# EAGLE design TT7N v1.2 (EAGLE 7.7.0)
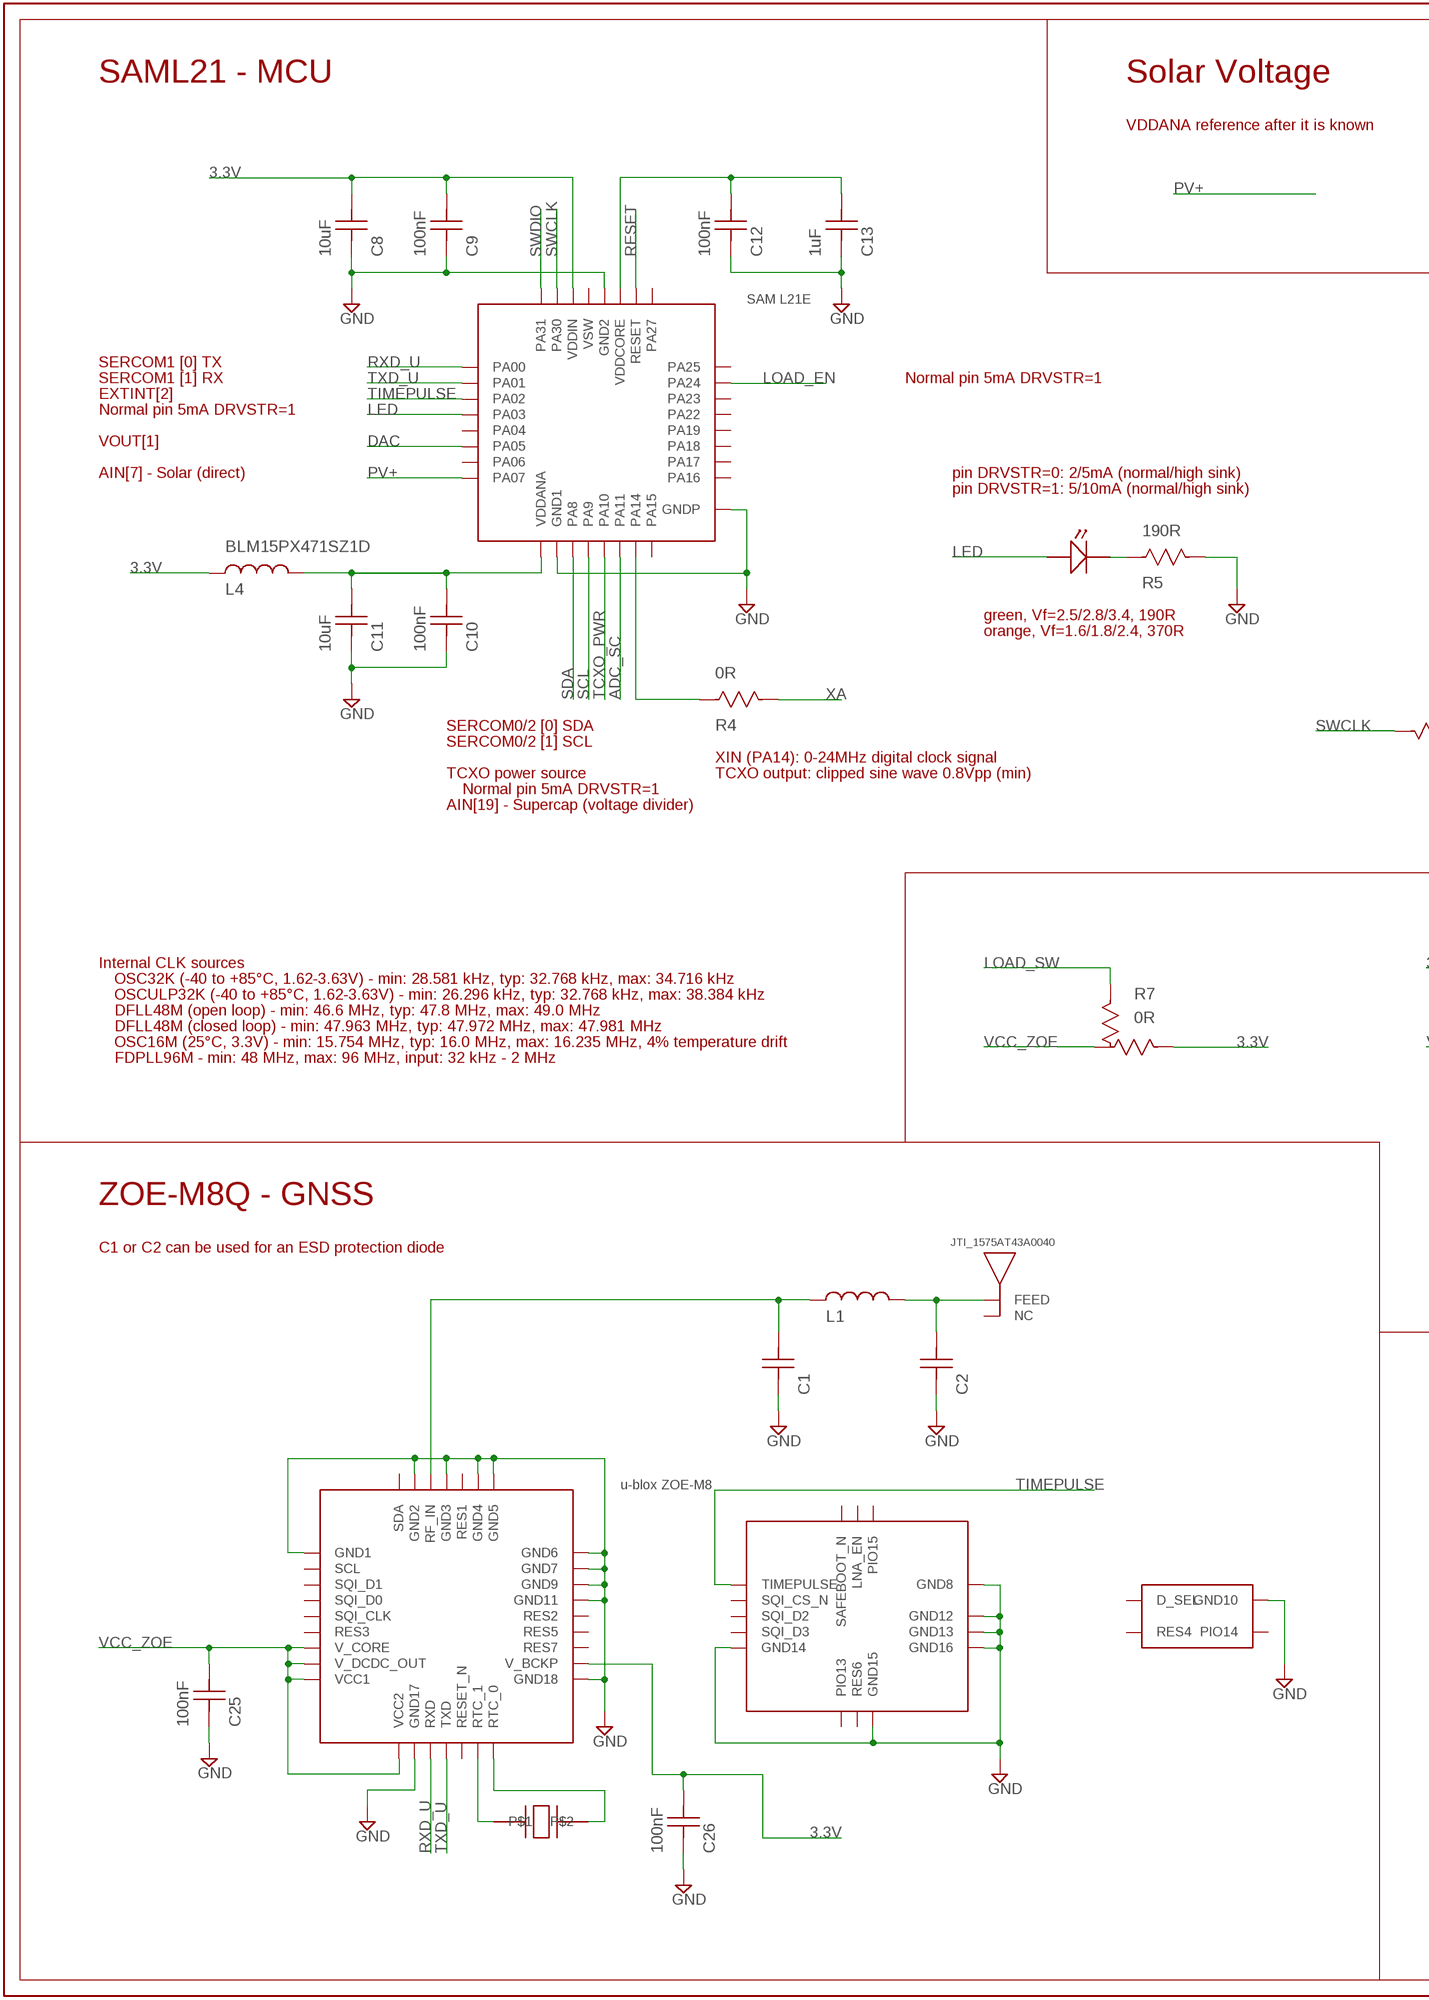
[diagram p0: schematic, sheet 1, part 1 of 2]
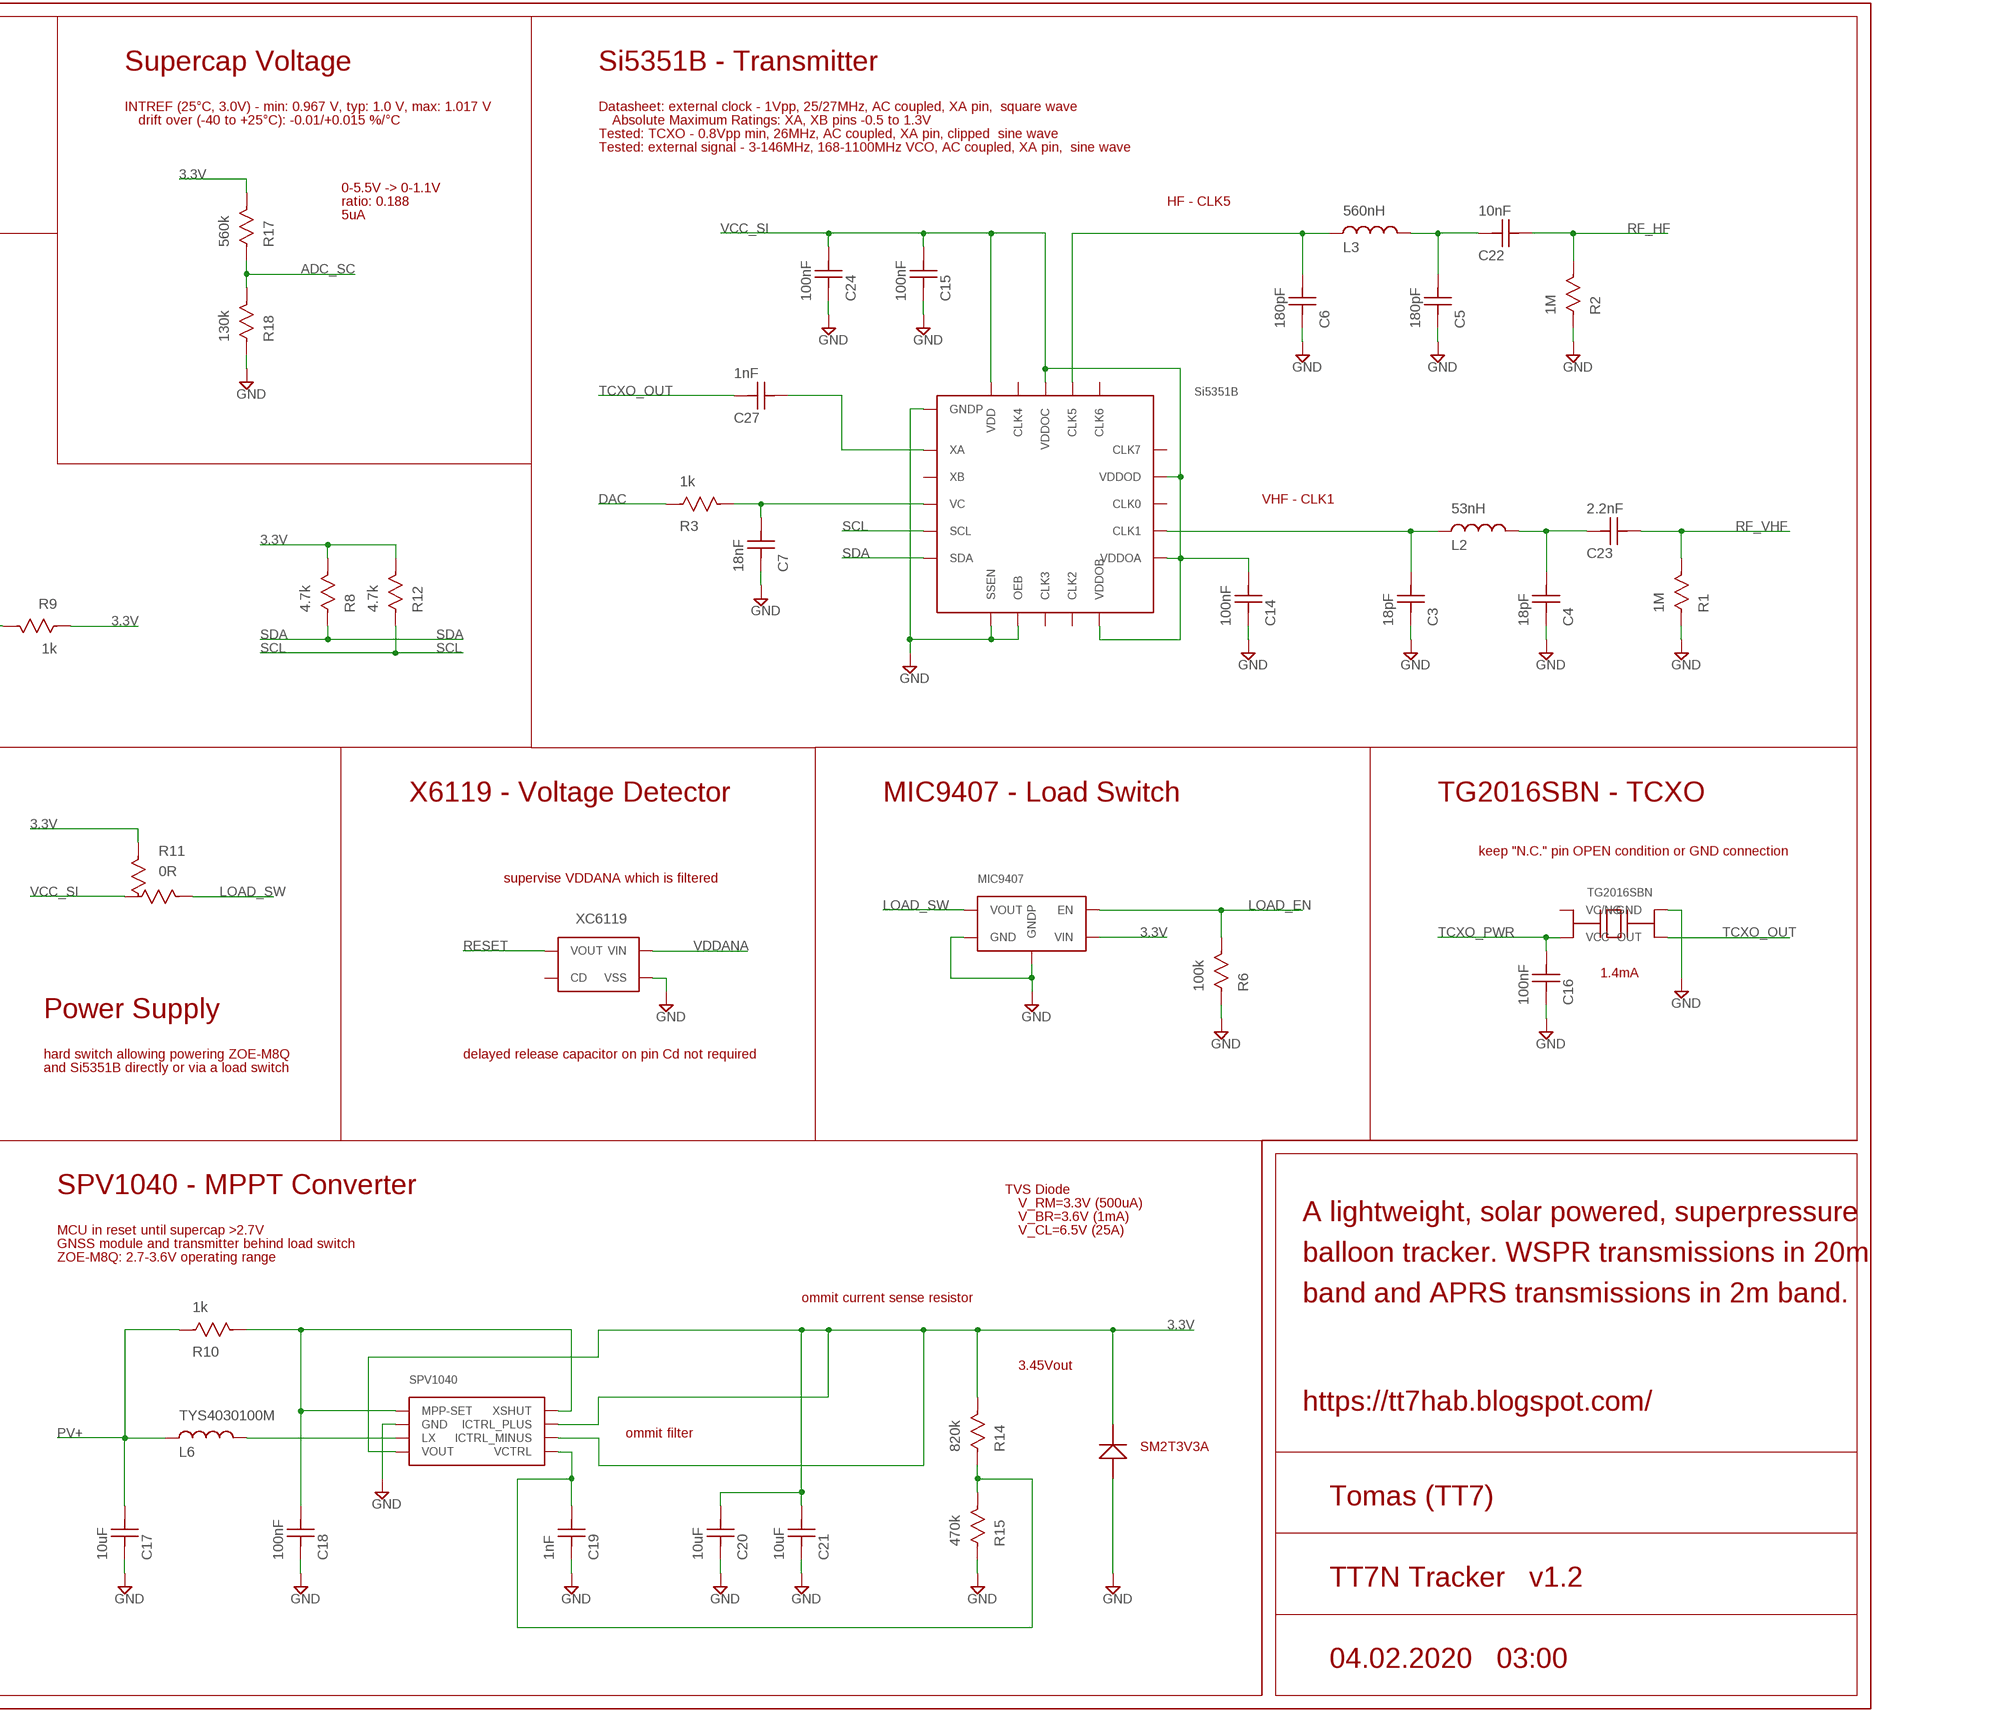
[diagram p1: schematic, sheet 1, part 2 of 2]

## Parts
ANT1  JTI_1575AT43A0040  [JTI_1575AT43A0040]
C1  CAP0402  [CAP0402]
C2  CAP0402  [CAP0402]
C3  18pF  CAP0402  [CAP0402]
C4  18pF  CAP0402  [CAP0402]
C5  180pF  CAP0402  [CAP0402]
C6  180pF  CAP0402  [CAP0402]
C7  18nF  CAP0402  [CAP0402]
C8  10uF  CAP0402  [CAP0402]
C9  100nF  CAP0402  [CAP0402]
C10  100nF  CAP0402  [CAP0402]
C11  10uF  CAP0402  [CAP0402]
C12  100nF  CAP0402  [CAP0402]
C13  1uF  CAP0402  [CAP0402]
C14  100nF  CAP0402  [CAP0402]
C15  100nF  CAP0402  [CAP0402]
C16  100nF  CAP0402  [CAP0402]
C17  10uF  CAP0402  [CAP0402]
C18  100nF  CAP0402  [CAP0402]
C19  1nF  CAP0402  [CAP0402]
C20  10uF  CAP0402  [CAP0402]
C21  10uF  CAP0402  [CAP0402]
C22  10nF  CAP0402  [CAP0402]
C23  2.2nF  CAP0402  [CAP0402]
C24  100nF  CAP0402  [CAP0402]
C25  100nF  CAP0402  [CAP0402]
C26  100nF  CAP0402  [CAP0402]
C27  1nF  CAP0402  [CAP0402]
D1  SM2T3V3A  [SM2T3V3A]
L1  IND0402  [IND0402]
L2  53nH  IND0402  [IND0402]
L3  560nH  IND0402  [IND0402]
L4  BLM15PX471SZ1D  IND0402  [IND0402]
L6  TYS4030100M  [TYS4030100M]
LED1  LED0603  [LED0603]
R1  1M  RES0402  [RES0402]
R2  1M  RES0402  [RES0402]
R3  1k  RES0402  [RES0402]
R4  0R  RES0402  [RES0402]
R5  190R  RES0402  [RES0402]
R6  100k  RES0402  [RES0402]
R7  0R  RES0402-3  [RES0402-3]
R8  4.7k  RES0402  [RES0402]
R9  1k  RES0402  [RES0402]
R10  1k  RES0402  [RES0402]
R11  0R  RES0402-3  [RES0402-3]
R12  4.7k  RES0402  [RES0402]
R14  820k  RES0402  [RES0402]
R15  470k  RES0402  [RES0402]
R17  560k  RES0402  [RES0402]
R18  130k  RES0402  [RES0402]
TCXO1  TG2016SBN  [TG2016SBN]
U1  SPV1040  [SPV1040]
U2  SAML21E18B-MUT  [SAML21E18B-MUT]
U3  XC6119  [XC6119]
U4  UBLOX_ZOE-M8  [UBLOX_ZOE-M8]
U5  SI5351B  [SI5351B]
U6  MIC9407  [MIC9407]
U7  CM8V-T1A  [CM8V-T1A]

## Nets
3.3V: C8.P$2 C9.P$2 C20.P$2 C21.P$2 C26.P$2 D1.CATHODE L4.P$1 R7.3 R8.P$2 R9.P$1 R11.1 R12.P$2 R14.P$2 R17.P$2 U1.ICTRL_MINUS U1.ICTRL_PLUS U1.VOUT U2.VDDIN U4.V_BCKP U6.VIN
ADC_SC: R17.P$1 R18.P$2 U2.PA11
CLK1: C3.P$2 L2.P$1 U5.CLK1
CLK5: C6.P$2 L3.P$1 U5.CLK5
DAC: R3.P$1 U2.PA05
GND: C1.P$1 C2.P$1 C3.P$1 C4.P$1 C5.P$1 C6.P$1 C7.P$1 C8.P$1 C9.P$1 C10.P$1 C11.P$1 C12.P$1 C13.P$1 C14.P$1 C15.P$1 C16.P$1 C17.P$1 C18.P$1 C19.P$1 C20.P$1 C21.P$1 C24.P$1 C25.P$1 C26.P$1 D1.ANODE R1.P$1 R2.P$1 R5.P$2 R6.P$1 R15.P$1 R18.P$1 TCXO1.GND U1.GND U2.GND1 U2.GND2 U2.GNDP U3.VSS U4.GND1 U4.GND2 U4.GND3 U4.GND4 U4.GND5 U4.GND6 U4.GND7 U4.GND8 U4.GND9 U4.GND10 U4.GND11 U4.GND12 U4.GND13 U4.GND14 U4.GND15 U4.GND16 U4.GND17 U4.GND18 U5.GNDP U5.OEB U5.SSEN U6.GND U6.GNDP
LED: LED1.ANODE U2.PA03
LOAD_EN: R6.P$2 U2.PA24 U6.EN
LOAD_SW: R7.1 R11.3 U6.VOUT
N$3: C7.P$2 R3.P$2 U5.VC
N$4: R4.P$1 U2.PA14
N$5: LED1.CATHODE R5.P$1
N$8: U4.RTC_0 U7.P$2
N$10: C12.P$2 C13.P$2 U2.VDDCORE
N$13: L6.P2 U1.LX
N$15: C5.P$2 C22.P$1 L3.P$2
N$16: C18.P$2 R10.P$2 U1.MPP-SET U1.XSHUT
N$19: C19.P$2 R14.P$1 R15.P$2 U1.VCTRL
N$20: U4.RTC_1 U7.P$1
N$22: C4.P$2 C23.P$1 L2.P$2
PV+: C17.P$2 L6.P1 R10.P$1 U2.PA07
RESET: U2.RESET U3.VOUT
RF_HF: C22.P$2 R2.P$2
RF_IN: C1.P$2 L1.P$1 U4.RF_IN
RF_UHF: ANT1.FEED C2.P$2 L1.P$2
RF_VHF: C23.P$2 R1.P$2
RXD_U: U2.PA00 U4.RXD
SCL: R12.P$1 U2.PA09(PA9) U5.SCL
SDA: R8.P$1 U2.PA08(PA8) U5.SDA
SWCLK: R9.P$2 U2.PA30
SWDIO: U2.PA31
TCXO_OUT: C27.P$1 TCXO1.OUT
TCXO_PWR: C16.P$2 TCXO1.VCC U2.PA10
TIMEPULSE: U2.PA02 U4.TIMEPULSE
TXD_U: U2.PA01 U4.TXD
VCC_SI: C14.P$2 C15.P$2 C24.P$2 R11.2 U5.VDD U5.VDDOA U5.VDDOB U5.VDDOC U5.VDDOD
VCC_ZOE: C25.P$2 R7.2 U4.V_CORE U4.V_DCDC_OUT U4.VCC1 U4.VCC2
VDDANA: C10.P$2 C11.P$2 L4.P$2 U2.VDDANA U3.VIN
XA: C27.P$2 R4.P$2 U5.XA
Unconnected: ANT1.NC TCXO1.VC/NC U2.PA04 U2.PA06 U2.PA15 U2.PA16 U2.PA17 U2.PA18 U2.PA19 U2.PA22 U2.PA23 U2.PA25 U2.PA27 U2.VSW U3.CD U4.D_SEL U4.LNA_EN U4.PIO13 U4.PIO14 U4.PIO15 U4.RES1 U4.RES2 U4.RES3 U4.RES4 U4.RES5 U4.RES6 U4.RES7 U4.RESET_N U4.SAFEBOOT_N U4.SCL U4.SDA U4.SQI_CLK U4.SQI_CS_N U4.SQI_D0 U4.SQI_D1 U4.SQI_D2 U4.SQI_D3 U5.CLK0 U5.CLK2 U5.CLK3 U5.CLK4 U5.CLK6 U5.CLK7 U5.XB

## Notes on the sheet
- SAML21 - MCU | Solar Voltage | Supercap Voltage | Si5351B - Transmitter
- VDDANA reference after it is known | INTREF (25°C, 3.0V) - min: 0.967 V, typ: 1.0 V, max: 1.017 V | Datasheet: external clock - 1Vpp, 25/27MHz, AC coupled, XA pin,  square wave
- drift over (-40 to +25°C): -0.01/+0.015 %/°C | Absolute Maximum Ratings: XA, XB pins -0.5 to 1.3V
- Tested: TCXO - 0.8Vpp min, 26MHz, AC coupled, XA pin, clipped  sine wave
- Tested: external signal - 3-146MHz, 168-1100MHz VCO, AC coupled, XA pin,  sine wave
- 0-5.5V -> 0-1.1V
- ratio: 0.188 | HF - CLK5
- 5uA
- SERCOM1 [0] TX
- SERCOM1 [1] RX | Normal pin 5mA DRVSTR=1
- EXTINT[2]
- Normal pin 5mA DRVSTR=1
- VOUT[1]
- AIN[7] - Solar (direct) | pin DRVSTR=0: 2/5mA (normal/high sink)
- pin DRVSTR=1: 5/10mA (normal/high sink)
- VHF - CLK1
- green, Vf=2.5/2.8/3.4, 190R
- orange, Vf=1.6/1.8/2.4, 370R
- SERCOM0/2 [0] SDA
- SERCOM0/2 [1] SCL
- XIN (PA14): 0-24MHz digital clock signal
- TCXO power source | TCXO output: clipped sine wave 0.8Vpp (min)
- Normal pin 5mA DRVSTR=1
- AIN[19] - Supercap (voltage divider)
- X6119 - Voltage Detector | MIC9407 - Load Switch | TG2016SBN - TCXO
- Internal CLK sources
- OSC32K (-40 to +85°C, 1.62-3.63V) - min: 28.581 kHz, typ: 32.768 kHz, max: 34.716 kHz
- OSCULP32K (-40 to +85°C, 1.62-3.63V) - min: 26.296 kHz, typ: 32.768 kHz, max: 38.384 kHz | keep "N.C." pin OPEN condition or GND connection
- DFLL48M (open loop) - min: 46.6 MHz, typ: 47.8 MHz, max: 49.0 MHz
- DFLL48M (closed loop) - min: 47.963 MHz, typ: 47.972 MHz, max: 47.981 MHz | supervise VDDANA which is filtered
- OSC16M (25°C, 3.3V) - min: 15.754 MHz, typ: 16.0 MHz, max: 16.235 MHz, 4% temperature drift
- FDPLL96M - min: 48 MHz, max: 96 MHz, input: 32 kHz - 2 MHz
- 1.4mA
- Power Supply
- ZOE-M8Q - GNSS
- hard switch allowing powering ZOE-M8Q | delayed release capacitor on pin Cd not required
- C1 or C2 can be used for an ESD protection diode | and Si5351B directly or via a load switch
- SPV1040 - MPPT Converter | TVS Diode
- V_RM=3.3V (500uA)
- V_BR=3.6V (1mA) | A lightweight, solar powered, superpressure
- MCU in reset until supercap >2.7V | V_CL=6.5V (25A)
- GNSS module and transmitter behind load switch
- ZOE-M8Q: 2.7-3.6V operating range | balloon tracker. WSPR transmissions in 20m
- ommit current sense resistor | band and APRS transmissions in 2m band.
- 3.45Vout
- https://tt7hab.blogspot.com/
- ommit filter
- SM2T3V3A
- Tomas (TT7)
- TT7N Tracker   v1.2
- 04.02.2020   03:00

## Library data of the parts
ANT1 = TT7:JTI_1575AT43A0040: JTI_1575AT43A0040 GNSS antenna footprint.
C1-C27 = TT7:CAP0402: CAPACITOR 0402 - 1 x 0.5 x 0.35mm
D1 = TT7:SM2T3V3A: SM2T3V3A TVS diode footprint
L1-L4 = TT7:IND0402: INDUCTOR 0402 - 1 x 0.5 x 0.35mm
L6 = TT7:TYS4030100M: TYS4030100M inductor footprint.
LED1 = TT7:LED0603: LED 0603
R1-R6 R8-R10 R12 R14 R15 R17 R18 = TT7:RES0402: RESISTOR 0402 - 1 x 0.5 x 0.35mm
R7 R11 = TT7:RES0402-3: Resistor Switch.
TCXO1 = TT7:TG2016SBN: TG2016SBN TCXO in a 2.0x1.6mm package.
U1 = TT7:SPV1040: SPV1040 high efficiency solar battery charger with embedded MPPT in a TSSOP8 package.
U2 = TT7:SAML21E18B-MUT: Atmel's SAM L21E18B in a 32 pin QFN package.
U3 = TT7:XC6119: XC6119 supervisor IC in a USPN-4 package.
U4 = TT7:UBLOX_ZOE-M8: U-blox ZOE-M8 footprint.
U5 = TT7:SI5351B: Si5351B transmitter.
U6 = TT7:MIC9407: MIC9407 load switch in MLF package footprint.
U7 = TT7:CM8V-T1A: CM8V-T1A 32.768kHz crystal footprint.

## Board
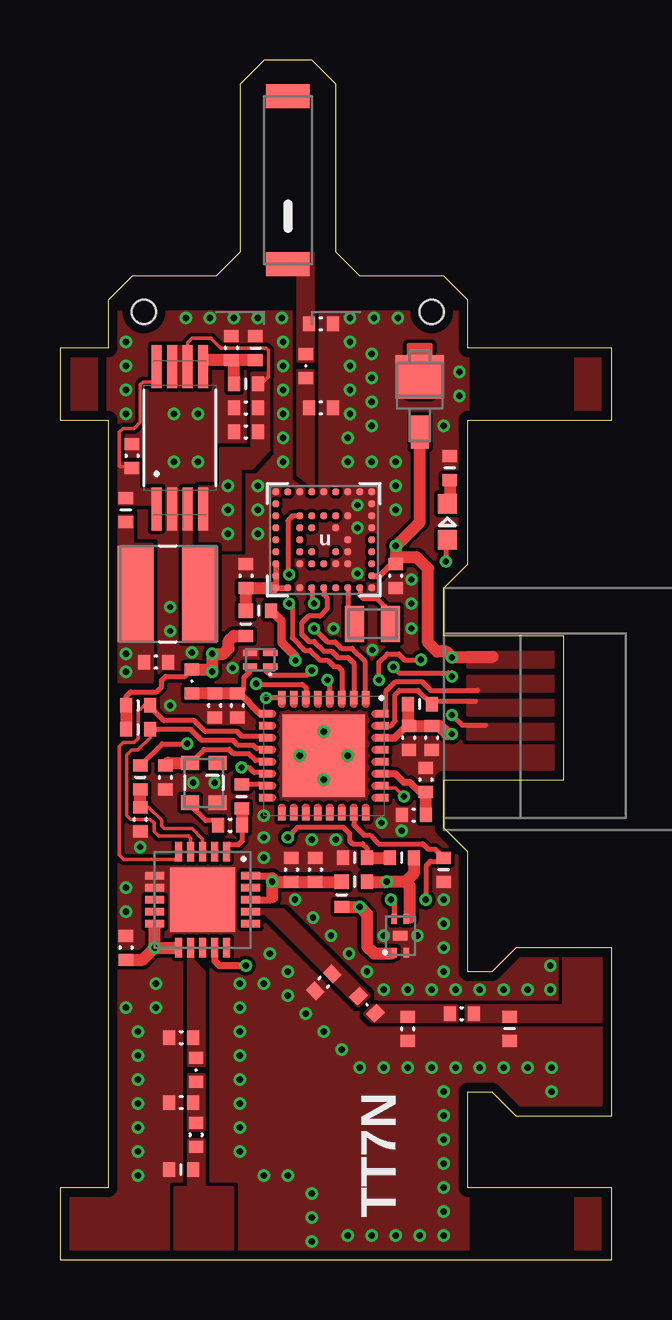
[diagram p2: board, top side]
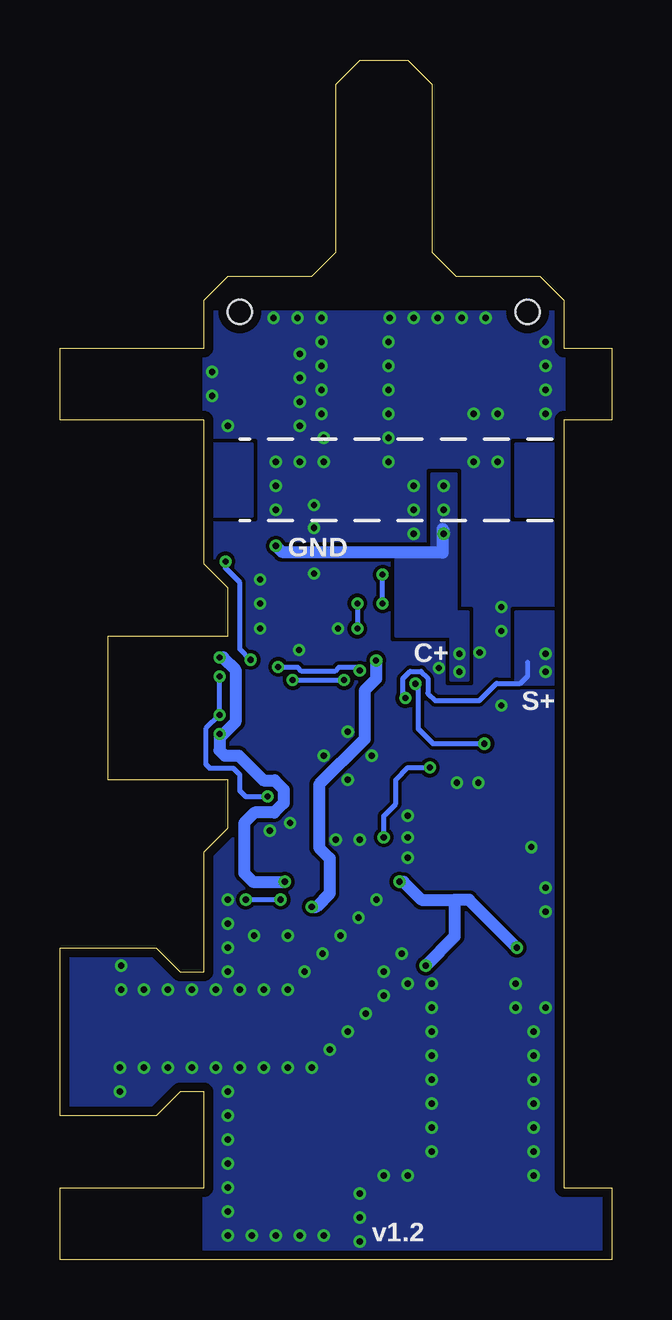
[diagram p3: board, bottom side, seen from below]

Size 23 x 50 mm. Coordinates in mm from the lower left corner, seen from the top.
Outline: 0,0 23,0 23,3 17,3 17,7 18,7 19,6 23,6 23,13 19,13 18,12 17,12 17,17 16,18 16,20 21,20 21,26 16,26 16,28 17,29 17,35 23,35 23,38 17,38 17,40 16,41 12.5,41 11.5,42 11.5,49 10.5,50 8.5,50 7.5,49 7.5,42 6.5,41 3,41 2,40 2,38 0,38 0,35 2,35 2,3 0,3 0,0
Copper layers (1*16): Top 0.035559375mm / dielectric 1.6mm / Bottom 0.035559375mm
Design rules "oshpark-2layer *": minimum track width 6mil, minimum drill 10mil, track to track 6mil, track to pad 6mil, pad to pad 6mil, via to via 6mil, smd to smd 0mil, copper to edge 15mil, drill to drill 6mil, minimum pad ring 5mil, minimum via ring 5mil, stop-mask expansion 2.5mil, vias tented up to drill 22mil, thermal gap 10mil
Holes 1 mm at 15.5,39.5 3.5,39.5

### Footprints (pad centres in the part's own frame; a part is rotated, then mirrored left to right if it is on the bottom)
JTI_1575AT43A0040 = smd 1 x 1.8: FEED -3.5,0; NC 3.5,0
CAP0402 = smd 0.5 x 0.6: P$1 -0.5,0; P$2 0.5,0
SM2T3V3A = smd 1.82 x 2.03: ANODE -0.79,0 | smd 1.38 x 0.75: CATHODE 1.515,0
IND0402 = smd 0.5 x 0.6: P$1 -0.5,0; P$2 0.5,0
TYS4030100M = smd 1.5 x 4: P1 -1.35,0; P2 1.35,0
LED0603 = smd 0.8 x 0.8: ANODE -0.75,0; CATHODE 0.75,0
RES0402 = smd 0.5 x 0.6: P$1 -0.5,0; P$2 0.5,0
RES0402-3 = smd 0.6 x 0.5: 1 -0.55,1.05 | smd 0.6 x 0.6: 2 -0.55,0 | smd 0.5 x 0.6: 3 0.5,0
TG2016SBN = smd 0.6 x 0.75: GND 0.825,0.565; OUT 0.825,-0.565; VC/NC -0.825,0.565; VCC -0.825,-0.565
SPV1040 = smd 1.78 x 0.42: GND -2.97,0.325; ICTRL_MINUS 2.97,-0.325; ICTRL_PLUS 2.97,0.325; LX -2.97,-0.325; MPP-SET -2.97,0.975; VCTRL 2.97,-0.975; VOUT -2.97,-0.975; XSHUT 2.97,0.975
SAML21E18B-MUT = smd 0.3 x 0.55: GND1 -1.25,-2.425; GND2 0.25,2.425; PA08 -0.75,-2.425; PA09 -0.25,-2.425; PA10 0.25,-2.425; PA11 0.75,-2.425; PA14 1.25,-2.425; PA15 1.75,-2.425; PA27 1.75,2.425; PA30 -1.25,2.425; PA31 -1.75,2.425; RESET 1.25,2.425; VDDANA -1.75,-2.425; VDDCORE 0.75,2.425; VDDIN -0.75,2.425; VSW -0.25,2.425 | smd 3.45 x 3.45: GNDP 0,0 | smd 0.55 x 0.3: PA00 -2.425,1.75; PA01 -2.425,1.25; PA02 -2.425,0.75; PA03 -2.425,0.25; PA04 -2.425,-0.25; PA05 -2.425,-0.75; PA06 -2.425,-1.25; PA07 -2.425,-1.75; PA16 2.425,-1.75; PA17 2.425,-1.25; PA18 2.425,-0.75; PA19 2.425,-0.25; PA22 2.425,0.25; PA23 2.425,0.75; PA24 2.425,1.25; PA25 2.425,1.75
XC6119 = smd 0.25 x 0.6: CD 0.275,-0.425; VIN -0.275,0.425; VOUT -0.275,-0.425; VSS 0.275,0.425
UBLOX_ZOE-M8 = smd 0.27 x 0.27: D_SEL -0.5,0.5; GND1 -2,2; GND2 -1,2; GND3 0,2; GND4 1,2; GND5 1.5,2; GND6 2,2; GND7 2,1.5; GND8 1,1; GND9 2,1; GND10 0.5,0.5; GND11 2,0.5; GND12 1,0; GND13 1,-0.5; GND14 -1,-1; GND15 0.5,-1; GND16 1,-1; GND17 -1,-2; GND18 2,-2; LNA_EN 0,1; PIO13 -0.5,-1; PIO14 0.5,-0.5; PIO15 0.5,1; RES1 0.5,2; RES2 2,0; RES3 -2,-0.5; RES4 -0.5,-0.5; RES5 2,-0.5; RES6 0,-1; RES7 2,-1; RESET_N 0.5,-2; RF_IN -0.5,2; RTC_0 1.5,-2; RTC_1 1,-2; RXD -0.5,-2; SAFEBOOT_N -0.5,1; SCL -2,1.5; SDA -1.5,2; SQI_CLK -2,0; SQI_CS_N -1,0.5; SQI_D0 -2,0.5; SQI_D1 -2,1; SQI_D2 -1,0; SQI_D3 -1,-0.5; TIMEPULSE -1,1; TXD 0,-2; V_BCKP 2,-1.5; V_CORE -2,-1; V_DCDC_OUT -2,-1.5; VCC1 -2,-2; VCC2 -1.5,-2
SI5351B = smd 0.8 x 0.3: CLK0 2,0; CLK1 2,-0.5; CLK7 2,1; SCL -2,-0.5; SDA -2,-1; VC -2,0; VDDOA 2,-1; VDDOD 2,0.5; XA -2,1; XB -2,0.5 | smd 0.3 x 0.8: CLK2 0.5,-2; CLK3 0,-2; CLK4 -0.5,2; CLK5 0.5,2; CLK6 1,2; OEB -0.5,-2; SSEN -1,-2; VDD -1,2; VDDOB 1,-2; VDDOC 0,2 | smd 2.7 x 2.7: GNDP 0,0
MIC9407 = smd 0.23 x 0.4: EN -0.25,0.7; GND 0.25,-0.7; VIN 0.25,0.7; VOUT -0.25,-0.7 | smd 0.6 x 0.4: GNDP 0,0
CM8V-T1A = smd 0.8 x 1.5: P$1 -0.75,0; P$2 0.75,0

### Placement (x,y rotation side)
ANT1  9.5,45 90 top
C1  10.88,35.5 180 top
C2  10.88,39 180 top
C3  5.05,9.25 0 top
C4  5.05,6.55 0 top
C5  14.5,9.62 90 top
C6  11,11.55 45 top
C7  3.35,18.35 90 top
C8  15.5,21.75 90 top
C9  14.55,21.75 90 top
C10  7.4,23.1 90 top
C11  6.45,23.1 90 top
C12  15.25,20 270 top
C13  14.75,18.53 0 top
C14  2.75,13 270 top
C15  10.65,16.25 270 top
C16  4.4,20.1 90 top
C17  4,24.9 180 top
C18  3,33.5 270 top
C19  7.15,38 270 top
C20  7.75,35.5 0 top
C21  7.75,34.5 0 top
C22  16.75,10.25 0 top
C23  5.67,5.2 270 top
C24  9.65,16.25 270 top
C25  7.75,28.5 270 top
C26  14,28.5 90 top
C27  7.1,18.1 0 top
D1  15,36 270 top
L1  10.25,37.25 90 top
L2  5.67,7.9 270 top
L3  12.8,10.62 315 top
L4  5.5,24.1 270 top
L6  4.5,27.75 0 top
LED1  16.15,30.75 90 top
R1  5.05,3.75 0 top
R2  18.75,9.62 90 top
R3  3.35,20.1 270 top
R4  7.58,19.3 270 top
R5  16.25,33 90 top
R6  16,16.25 90 top
R7  7.75,26.5 270 top
R8  3.25,23.1 180 top
R9  15,23.15 0 top
R10  2.75,31.25 90 top
R11  11.75,15.2 270 top
R12  3.25,22.1 180 top
R14  7.75,36.5 0 top
R15  8.15,38 270 top
R17  14.25,16.75 0 top
R18  12.3,16.75 0 top
TCXO1  6,19.88 270 top
U1  5,34.25 90 top
U2  11,21 270 top
U3  8.35,25 90 top
U4  11,30 0 top
U5  5.95,15 270 top
U6  14.2,13.5 0 top
U7  13.03,26.5 0 top

### Tracks (layer width: path | path; a pad name or v marks a point on that pad's centre or on a via)
3.3V  (via drill 0.25)
  Top 0.152: U1.ICTRL_MINUS 5.33,38.23 5.5,38.4 6.3,38.4 6.3,38.39 6.69,38 8.6,38 8.7,37.9 8.7,36.81 8.39,36.5 R14.P$2
  Top 0.2: R8.P$2 2.75,23.46 2.95,23.66 4.04,23.66 4.24,23.86 4.24,24.14 4.4,24.3 5.2,24.3 L4.P$1 | U6.VIN 14.53,14.2 14.58,14.25
  Top 0.26: U4.V_BCKP 13.32,28.5 13.82,29 C26.P$2
  Top 0.31: U2.VDDIN 13.95,21.75 14.45,22.25 C9.P$2
  Top 0.5: R8.P$2 R12.P$2 | C26.P$2 v14,29.75 15,30.75 D1.CATHODE | L4.P$1 6.25,24.6 v6.35,24.5 v6.35,25.25 6.8,25.25 7.04,25.48 7.04,25.79 7.24,26 R7.3 | R9.P$1 14.5,22.25 C9.P$2 C8.P$2 15.8,22.25 16.15,21.9 v16.35,21.9 | 18.04,25.12 16.37,25.12 v16.35,25.1 16.11,25.34 15.72,25.34 15.35,25.72 15.35,28.8 14.88,29.26 14,29.26 C26.P$2 | C26.P$2 14.05,29.15 | R11.1 v13.62,15.75 14.4,15.75 | R17.P$2 14.75,16.1 14.4,15.75 | 14.4,15.75 14.58,15.57 14.58,14.25
  Bottom 0.5: v14,29.75 13.75,29.5 7.07,29.5 7.03,29.46 7.03,30.47 v7,30.25 | v16.35,25.1 16.19,25.1 15.68,24.59 15.68,22.41 16.19,21.9 v16.35,21.9 16.35,21.22 16.13,21.01 15.55,21.01 14.51,19.97 14.05,19.97 13.67,19.59 13.67,19.03 13.68,19.03 14.07,18.63 14.88,18.63 15.31,18.2 15.31,16.11 14.96,15.75 v13.62,15.75
  other vias: 7,31.25 7,32.25
  pour Top: 17,25.3 21,25.3 21,24.7 17,24.7
  pour Top (no thermals): 7.5,29.6 7.5,33 8,33 8,33.8 6.7,33.8 6.7,32.2 5.84,32.2 5.84,29.95 6.8,29.95 6.8,29.6
  pour Top (no thermals): 4.55,38.05 5.45,38.05 5.45,36.4 4.55,36.4
  pour Top (no thermals): 8,36.95 8.7,36.95 8.7,33.75 8,33
  pour Bottom (no thermals): 6.5,32.75 7.5,32.75 7.5,29.5 9,29.5 9,26 6.7,26 6.7,24.15 6,24.15 6,27 6.5,27
ADC_SC  (via drill 0.25)
  Top 0.2: U2.PA11 8.53,20.3 8.1,20.3 7.88,20.51 v7.58,20.51 | v9.5,17.6 9.93,18.03 11.81,18.03 12.07,17.76 12.07,17.45 12.19,17.33 12.62,17.33 12.8,17.15 R18.P$2
  Top 0.5: R18.P$2 R17.P$1
  Bottom 0.2: v9.5,17.6 9.5,18.5 9,19 9,20 8.49,20.51 v7.58,20.51
CLK1
  pour Top (no thermals): 5.36,8.1 5.36,12.9 5.53,12.9 5.53,12.5 6,12 6,8.1
CLK5
  pour Top (no thermals): 9,14 12.45,10.55 12.9,11 12.43,11.47 10.43,13.47 9.32,14.57 7.65,14.57 7.65,14.43 8.55,14.43
DAC  (via drill 0.25)
  Top 0.2: R3.P$1 4.25,21.5 v5.3,21.5 | v8.18,24 8.2,23.98 10.11,23.98 10.25,23.84 U2.PA05
  Bottom 0.2: v5.3,21.5 7.43,21.5 8.07,22.13 8.07,23.89 v8.18,24
GND  (via drill 0.25)
  other vias: 9.25,39.25 9.3,37.25 9.3,35.25 9.3,33.25 12.1,39.25 12.1,37.25 12.1,35.25 3.25,3.5 3.25,5.5 3.25,7.5 3.25,9.5 12,33.25 9.3,38.25 9.3,36.25 9.3,34.25 12,34.25 12.1,36.25 12.1,38.25 3.25,4.5 3.25,6.5 3.25,8.5 4,10.5 4,11.5 16,6 16,4 16,2 14,1 12,1 10.5,2.75 10.5,1.75 7.5,9.5 7.5,8.5 7.5,7.5 7.5,6.5 7.5,5.5 7.5,4.5 8.5,3.5 9.5,3.5 7.5,10.5 7.5,11.5 10.5,0.75 13,1 16,3 16,5 16,1 2.75,10.5 13.1,39.25 8.25,39.25 14.1,39.25 7.25,39.25 6.25,39.25 5.25,39.25 16,7 15.5,8 16.5,8 17.5,8 18.5,8 20.5,8 20.5,7 14.5,8 13.5,8 11.75,8.75 20.45,12.25 18.5,11.25 20.45,11.25 17.5,11.25 16.5,11.25 15.5,11.25 14.5,11.25 12.5,8 13.5,11.25 12.8,12 11,9.5 10.25,10.25 9.5,11 8.5,11.5 12.05,12.75 11.3,13.5 10.55,14.25 9.5,12 8.75,12.75 8.25,30.25 8.25,31.25 8.25,32.25 2.75,36.25 2.75,37.25 2.75,38.25 2.75,35.25 13,33.25 5.55,19.88 4.75,33.25 5.75,33.25 4.75,35.25 5.75,35.25 2.75,15.5 2.75,14.5 19.5,11.25 19.5,8 15,1 14,33.25 14,32.25 14,31.25 9.8,15 8.5,16.75 8.5,17.6 16,34.75 16.65,37 16.65,36 14.65,28.35 12.4,28.6 12.4,30.5 12.4,31.45 11.4,26.3 14.65,26.3 14.65,27.35 13.03,25.4 13,34.75 13,37.75 13,36.75 13,35.75 3.35,17.19 6.45,19.88 4.6,23.1 5.5,25.3 4.6,26.2 4.6,27.2 7.2,24.65 11,22 11,20 12,21 10,21 16,12 16,13 16,14 10.5,17.5 8.5,18.5 11.5,17.5 16,15 13.4,18.2 14.25,17.88 13.5,13.5 14.9,13.5
  pour Top (rank 2, no thermals): 0,0 17,0 17,6 23,6 23,13 17,13 17,20 21,20 21,26 17,26 17,39.5 2,39.5 2,3 0,3
  pour Bottom (rank 2, no thermals): 2,39.5 17,39.5 17,26 21,26 21,20 17,20 17,13 23,13 23,6 17,6 17,0 0,0 0,3 2,3
LED  (via drill 0.25)
  Top 0.2: U2.PA03 11.25,24.05 v11.15,24.15 | v13.3,24.15 13.3,24.9 13.65,25.24 14.12,25.24 14.36,25 v15.05,25 | LED1.ANODE 16.1,29.95 v16.1,29.1
  Bottom 0.2: v13.3,24.15 v11.15,24.15 | v15.05,25 15.5,25.45 15.5,28.21 16.1,28.82 v16.1,29.1
LOAD_EN  (via drill 0.25)
  Top 0.152: 15.13,17.33 14.25,17.33
  Top 0.2: U2.PA24 12.25,18.12 12.67,17.7 12.92,17.7 13.29,17.33 15.13,17.33 15.35,17.11 15.64,17.11 R6.P$2 15.85,16.59 15.45,16.59 15.27,16.42 15.27,15.02 v15.25,15
  Top 0.23: U6.EN 13.95,14.86 v13.8,15
  Bottom 0.2: v13.8,15 v15.25,15
LOAD_SW  (via drill 0.25)
  Top 0.2: U6.VOUT 13.89,12.75 13.81,12.75
  Top 0.35: v9.82,24.97 9.82,25.14 9.24,25.72 9.24,26.61 R7.1
  Top 0.5: R11.3 v12.5,14.7 12.81,14.39 12.81,13.05 13.11,12.75 13.81,12.75
  Bottom 0.5: v9.82,24.97 9.82,24.2 10.3,23.71 10.3,21.68 12.19,19.79 12.19,17.16 11.75,16.72 11.75,15.26 12.31,14.7 v12.5,14.7
N$1
  pour Top: 21.5,35 21.5,38 22.5,38 22.5,35
N$2
  pour Top: 21.5,0 21.5,3 22.5,3 22.5,0
N$3
  Top 0.152: U5.VC 5.95,17.52 5.5,17.97 4.34,17.97 4.23,18.08 4.23,18.32 3.71,18.85 C7.P$2
  Top 0.5: C7.P$2 R3.P$2
N$4
  Top 0.2: U2.PA14 8.53,19.8 R4.P$1
N$5
  Top 0.5: R5.P$1 16.25,31.6 LED1.CATHODE
N$6
  pour Bottom (no thermals): 17,31 15,31 15,34 17,34
N$7
  pour Bottom (no thermals): 2,34 4,34 4,31 2,31
N$8
  Top 0.2: U4.RTC_0 12.5,27.7 12.65,27.55 13.23,27.55 13.78,27 U7.P$2
  Top 0.26: 13.51,26.77 U7.P$2
N$10
  Top 0.3: 13.75,20.25 U2.VDDCORE 13.98,20.25 14.35,19.88 14.6,19.88 14.98,19.5 C12.P$2
  Top 0.5: C13.P$2 C12.P$2
N$13
  Top 0.152: L6.P2 5.33,27.75 5.33,29.02
  pour Top (no thermals): 5.17,32 5.47,32 5.47,28 5.17,28
N$15
  pour Top (no thermals): 16.55,9.94 16.55,10.57 13.03,10.57 12.7,10.25 13,9.94
N$16
  Top 0.152: U1.MPP-SET 4,31.28 4,32 | U1.XSHUT 4.02,36.63 3.96,36.58 3.46,36.58 3.35,36.47 3.35,34.9 3.09,34.64 2.62,34.64 2.46,34.49 2.46,33.07 2.49,33.05 2.95,33.05 C18.P$2
  pour Top (no thermals): 2,31.5 4.17,31.5 4.17,32.1 3.25,32.1 3.25,33.2 2,33.2
N$19
  Top 0.4: 8.2,37.45 R15.P$2 | 6.05,37.5 U1.VCTRL
  Top 0.5: R15.P$2 C19.P$2 | C19.P$2 6.05,37.5 | R14.P$1 7.25,37.4 C19.P$2
N$20
  Top 0.2: U4.RTC_1 12,26.77
  Top 0.26: 12,26.75 U7.P$1 12,26.77
N$21
  pour Top: 0.5,35 0.5,38 1.5,38 1.5,35
N$22
  pour Top (no thermals): 5.36,5.4 5.36,7.7 6,7.7 6,5.4
PV+  (via drill 0.25)
  Top 0.2: U2.PA07 9.22,23.4 v8.6,23.4
  Bottom 0.2: v8.6,23.4 8.7,23.5 8.7,24.22 8.4,24.52 7.95,24.52 7.66,24.23 7.66,23.6 7.35,23.3 5.52,23.3 4.8,24.02 3.8,24.02 3.5,24.32 C17.P$2
  other vias: 2.75,25.25 2.75,24.5
  pour Top (no thermals): 2,24.1 3.85,24.1 3.85,29.8 3,29.8 3,31 2,31
  pour Bottom (no thermals): 2,27 4,27 4,24 2,24
RESET  (via drill 0.25)
  Top 0.152: v14.35,19.3 13.98,19.66 13.51,19.66 U2.RESET
  Top 0.2: v10.5,24.55 10.29,24.34 8.79,24.34 8.57,24.56 8.57,24.73 U3.VOUT | v16.35,22.7 16.78,22.27 17.74,22.27 | v13.9,24.7 14.14,24.45 16.2,24.45 v16.35,24.3
  Bottom 0.2: v10.5,24.55 10.63,24.68 11.38,24.68 11.54,24.52 12.92,24.52 13.08,24.68 13.88,24.68 v13.9,24.7 | v16.35,24.3 v16.35,22.7 16.92,22.13 16.92,20.65 16.76,20.49 15.78,20.49 15.51,20.22 15.51,19.55 15.26,19.3 v14.35,19.3
  pour Top: 17,22.3 21,22.3 21,21.7 17,21.7
RF_HF
  pour Top (no thermals): 16.95,9.94 23,9.94 23,13 21,13 21,10.57 16.95,10.57
RF_IN
  pour Top (no thermals): 9.92,32.7 9.92,37.05 10.56,37.05 10.56,32 10.44,32 10.44,32.3
RF_UHF
  pour Top (no thermals): 9.92,41.92 10.56,41.92 10.56,37.45 9.92,37.45
RF_VHF
  pour Top (no thermals): 5.36,5 6,5 6,3 7.2,3 7.2,0 4.8,0 4.8,3 5.36,3
RXD_U  (via drill 0.25)
  Top 0.2: U4.RXD 10.5,27.45 v10.6,27.35 | v10.6,26.3 11.16,25.74 11.47,25.74 11.74,25.47 12.18,25.47 12.71,24.94 12.71,23.46 U2.PA00
  Bottom 0.2: v10.6,27.35 v10.6,26.3
SCL
  Top 0.152: U5.SCL 5.45,17.56 5.36,17.65 4.11,17.65 3.92,17.84 3.92,18.19 3.76,18.35 2.95,18.35 2.79,18.52 2.79,21.04 2.99,21.24 3.24,21.24 3.75,21.75 R12.P$1
  Top 0.2: U2.PA09 8.53,21.2 8.53,21.3 8.2,21.3 8.07,21.43 7.43,21.43 7.23,21.64 5.9,21.64 5.44,22.1 R12.P$1
SDA
  Top 0.152: 4.95,17.25 U5.SDA 4.95,16.68 2.66,16.68 2.47,16.87 2.47,21.38 2.64,21.56 3.1,21.56 3.25,21.71 3.25,22.85 3.5,23.1 R8.P$1
  Top 0.2: U2.PA08 8.52,21.8 7.59,21.8 7.39,22.01 6.06,22.01 5.6,22.46 4.32,22.46 3.75,23.04 R8.P$1
SWCLK
  Top 0.2: U2.PA30 13.8,22.25 13.98,22.43 13.98,23.55 14.15,23.72 14.93,23.72 R9.P$2 15.62,23.27 17.33,23.27
  pour Top: 21,22.7 17,22.7 17,23.3 21,23.3
SWDIO
  Top 0.2: U2.PA31 13.6,22.75 13.6,23.69 14,24.09 15.1,24.09 15.46,23.72 17.42,23.72
  pour Top: 21,23.7 17,23.7 17,24.3 21,24.3
TCXO_OUT
  Top 0.2: C27.P$1 6.4,18.3 6.07,18.3 5.44,18.94 TCXO1.OUT
TCXO_PWR
  Top 0.2: TCXO1.VCC 6,21.27 7.06,21.27 7.25,21.08 7.87,21.08 8.15,20.8 8.57,20.8 U2.PA10
  Top 0.5: C16.P$2 4.5,20.7 TCXO1.VCC
TIMEPULSE  (via drill 0.25)
  Top 0.2: U4.TIMEPULSE 9.7,31 9.5,30.8 9.5,28.6 v9.55,28.55 | v9.55,27.35 9.69,27.21 9.69,25.9 10.2,25.39 10.44,25.39 10.84,24.98 11.15,24.98 11.42,24.71 11.59,24.71 11.76,24.55 U2.PA02
  Bottom 0.2: v9.55,27.35 v9.55,28.55
TXD_U
  Top 0.2: U4.TXD 11,27.71 11.14,27.57 11.14,27.13 10.83,26.82 10.37,26.82 10.07,26.52 10.07,26.07 10.38,25.77 10.6,25.77 11.01,25.36 11.31,25.36 11.58,25.09 12.01,25.09 12.25,24.85 U2.PA01
VCC_SI  (via drill 0.25)
  Top 0.2: 3.95,13.85 U5.VDDOB | 4.8,13 U5.VDDOA | 8.81,15 8.8,15.01 8.8,15.1 8.85,15.1 | 8.85,16 v8.85,15.75
  Top 0.3: U5.VDDOD 6.45,12.45 6.65,12.25 v7.75,12.25 | U5.VDDOC 8.81,15 | U5.VDD 8.85,16
  Top 0.5: C14.P$2 3.45,12.5 v3.95,13 | v3.95,13 3.95,13.85 | v3.95,13 4.8,13 | v8.85,15.75 8.85,15.1 | v8.85,15.75 C24.P$2 C15.P$2 R11.2 | 8.85,15.9 v8.85,15.75
  Bottom 0.5: v3.95,13 5.95,15 6.53,15 | v7.75,12.25 6.53,13.47 6.53,15 | 6.53,15 7.92,15 8.67,15.75 v8.85,15.75
VCC_ZOE
  Top 0.26: U4.V_CORE U4.V_DCDC_OUT U4.VCC1 | U4.VCC1 U4.VCC2 | 8.9,28 U4.VCC1
  Top 0.5: R7.2 C25.P$2 8.9,28
VDDANA
  Top 0.2: 7.5,23.6 7.67,23.76 7.67,24.25 7.92,24.51 U3.VIN
  Top 0.3: U2.VDDANA 8.35,22.75 7.5,23.6 C10.P$2
  Top 0.5: C10.P$2 C11.P$2 L4.P$2
XA
  Top 0.2: U5.XA 6.95,17.25 7,17.3 7.46,17.3 7.6,17.44 C27.P$2
  Top 0.5: R4.P$2 7.6,18.77 C27.P$2

### Text on the board
tPlace: TT7N
bPlace: GND | C+ | S+ | v1.2
tDocu: GNSS antenna pads | DGH105Q5R5 supercapacitor | VHF antenna support pad | HF antenna support pad | Solar panel support pad (1) | Solar panel support pad (2) | GND pad (-) | SuperCap pad (+) | Programming Port | Solar panel pad (+) | (PCI Express) | VTREF | SWDIO | SWCLK | RESET | Power Supply Switches | GND | VCC_ZOE | LOAD_SW | 3.3V | VCC_SI | 3.3V | HF antenna pads | LOAD_SW | HF antenna support pad | VHF antenna pads